# EAGLE design Galaxydrive (EAGLE 9.6.2)
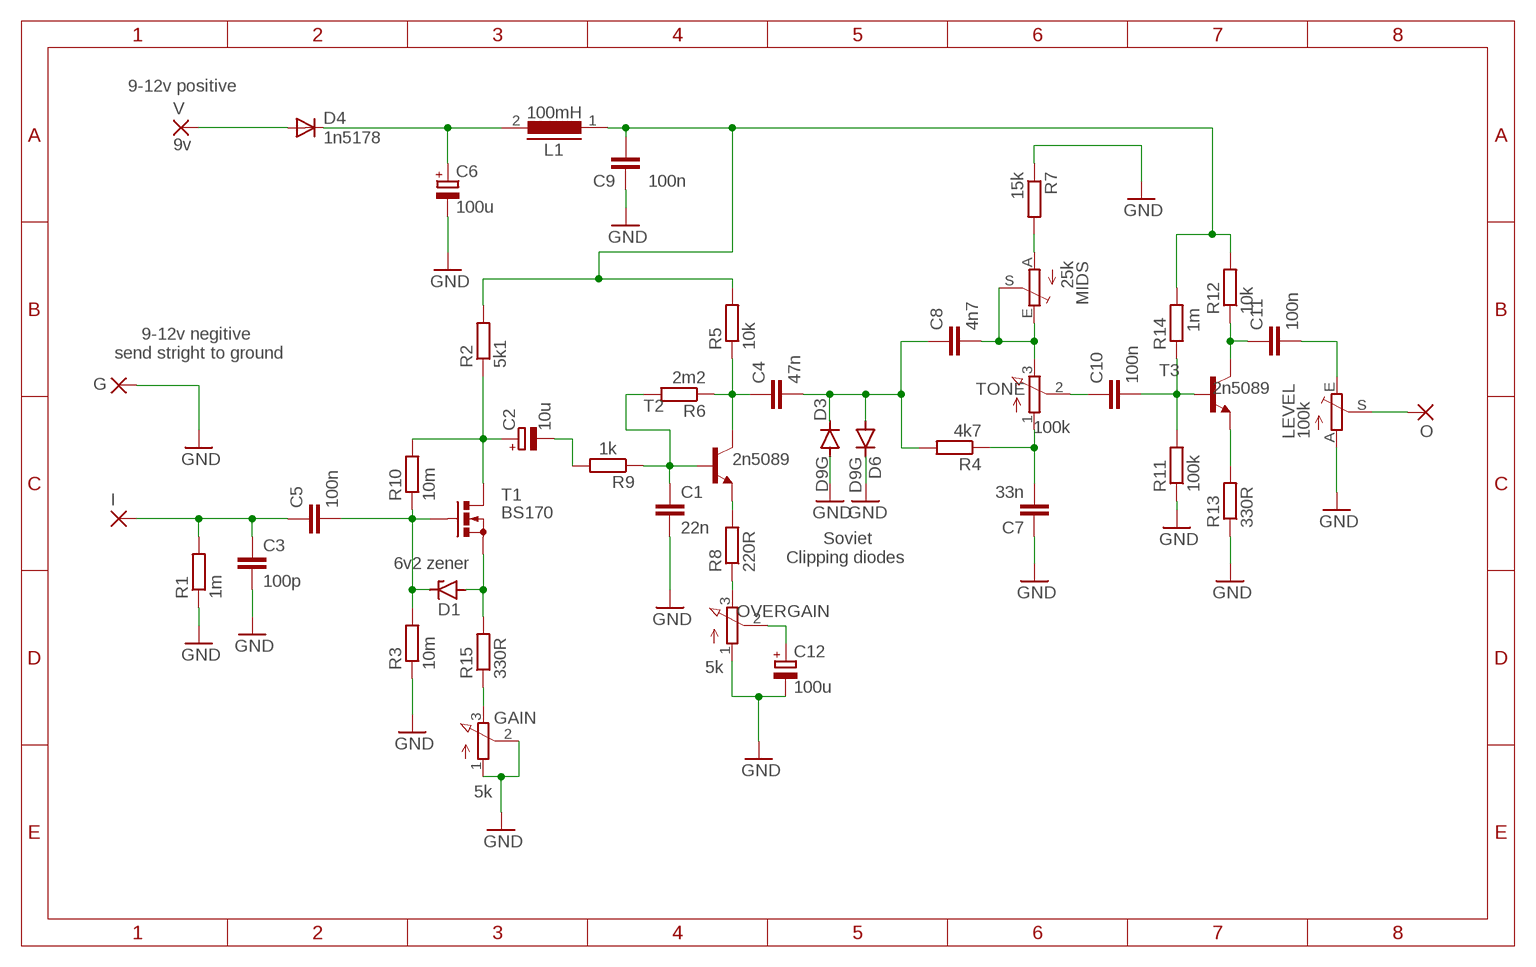
[diagram p0: schematic, sheet 1]

## Parts
C1  22n  C5/2.5  [C5B2.5]
C2  10u  CPOL-EUE1.8-4  [E1,8-4]
C3  100p  C5/2.5  [C5B2.5]
C4  47n  C5/2.5  [C5B2.5]
C5  100n  C5/2.5  [C5B2.5]
C6  100u  CPOL-EUE2-4  [E2-4]
C7  33n  C5/2.5  [C5B2.5]
C8  4n7  C5/2.5  [C5B2.5]
C9  100n  C5/2.5  [C5B2.5]
C10  100n  C5/2.5  [C5B2.5]
C11  100n  C5/2.5  [C5B2.5]
C12  100u  CPOL-EUE2-4  [E2-4]
D1  6v2 zener  BZX90  [DO34Z7]
D3  D9G  OA91  [DO07]
D4  1n5178  DIODE-D-7.5  [D-7.5]
D6  D9G  OA91  [DO07]
G  2,15/1,0  [2,15/1,0]
GAIN  5k  HEXPOT1  [3RP/1610N]
I  2,15/1,0  [2,15/1,0]
L1  100mH  MCC10  [MCC10]
LEVEL  100k  TRIM_EU-B25P  [B25P]
MIDS  25k  TRIM_EU-B25P  [B25P]
O  2,15/1,0  [2,15/1,0]
OVERGAIN  5k  HEXPOT1  [3RP/1610N]
R1  1m  R-EU_0207/7  [0207/7]
R2  5k1  R-EU_0207/7  [0207/7]
R3  10m  R-EU_0207/7  [0207/7]
R4  4k7  R-EU_0207/7  [0207/7]
R5  10k  R-EU_0207/7  [0207/7]
R6  2m2  R-EU_0207/7  [0207/7]
R7  15k  R-EU_0207/7  [0207/7]
R8  220R  R-EU_0207/7  [0207/7]
R9  1k  R-EU_0207/7  [0207/7]
R10  10m  R-EU_0207/7  [0207/7]
R11  100k  R-EU_0207/7  [0207/7]
R12  10k  R-EU_0207/7  [0207/7]
R13  330R  R-EU_0207/7  [0207/7]
R14  1m  R-EU_0207/7  [0207/7]
R15  330R  R-EU_0207/7  [0207/7]
T1  BS170  [SOT54E]
T2  2n5089  2N3904  [TO92]
T3  2n5089  2N3904  [TO92]
TONE  100k  HEXPOT1  [3RP/1610N]
V  9v  2,15/1,0  [2,15/1,0]

## Nets
GND: C1.2 C3.2 C6.- C7.1 C9.1 C12.- D3.A D6.C G.1(P) GAIN.1(A) GAIN.2(S) LEVEL.A OVERGAIN.1(A) R1.1 R3.1 R7.1 R11.1 R13.1
N$1: C2.+ R2.1 R10.2 T1.D
N$2: C4.2 C8.1 D3.C D6.A R4.2
N$3: C5.2 D1.C R3.2 R10.1 T1.G
N$4: D1.A R15.2 T1.S
N$5: C9.2 L1.1 R2.2 R5.2 R12.2 R14.2
N$6: C2.- R9.2
N$7: C8.2 MIDS.E MIDS.S TONE.3(E)
N$8: R8.2 T2.3(E)
N$9: C7.2 R4.1 TONE.1(A)
N$10: C3.1 C5.1 I.1(P) R1.2
N$11: C10.2 R11.2 R14.1 T3.2(B)
N$12: OVERGAIN.3(E) R8.1
N$13: C12.+ OVERGAIN.2(S)
N$14: C1.1 R6.2 R9.1 T2.2(B)
N$15: C11.1 R12.1 T3.1(C)
N$16: C4.1 R5.1 R6.1 T2.1(C)
N$18: R13.2 T3.3(E)
N$19: MIDS.A R7.2
N$20: GAIN.3(E) R15.1
N$21: LEVEL.S O.1(P)
N$22: C10.1 TONE.2(S)
N$23: C11.2 LEVEL.E
N$27: C6.+ D4.C L1.2
N$28: D4.A V.1(P)

## Notes on the sheet
- 9-12v positive
- 9-12v negitive 
  send stright to ground
- Soviet
  Clipping diodes

## Library data of the parts
C1 C3-C5 C7-C11 = hexcapacitor-wima:C: CAPACITOR naming: grid - package width
C2 C6 C12 = hexresistor:CPOL-EU: POLARIZED CAPACITOR, European symbol; SPICEPREFIX: C
D1 = diode:BZX90: Z DIODE
D3 D6 = diode:OA91: DIODE germanium signal diode 115 V 50 mA
D4 = diode-1:DIODE-: DIODE
G I O V = wirepad:2,15/1,0: THROUGH-HOLE PAD
GAIN OVERGAIN TONE = hexpedalpot:HEXPOT1: 16mm Potentiometer one level Source: http://www.alphapotentiometers.net/html/16mm_pot_2.html
L1 = inductors:MCC10: INDUCTOR; SPICEPREFIX: L
LEVEL MIDS = hexpedalpot16mm low pro:TRIM_EU-: POTENTIOMETER
R1-R15 = hexresistor:R-EU_: RESISTOR, European symbol; SPICEPREFIX: R
T1 = transistor-small-signal:BS170: N-CHANNEL MOS FET
T2 T3 = transistor:2N3904: NPN TRANSISTOR

## Net classes
0 default: width 0.254 mm

## Board
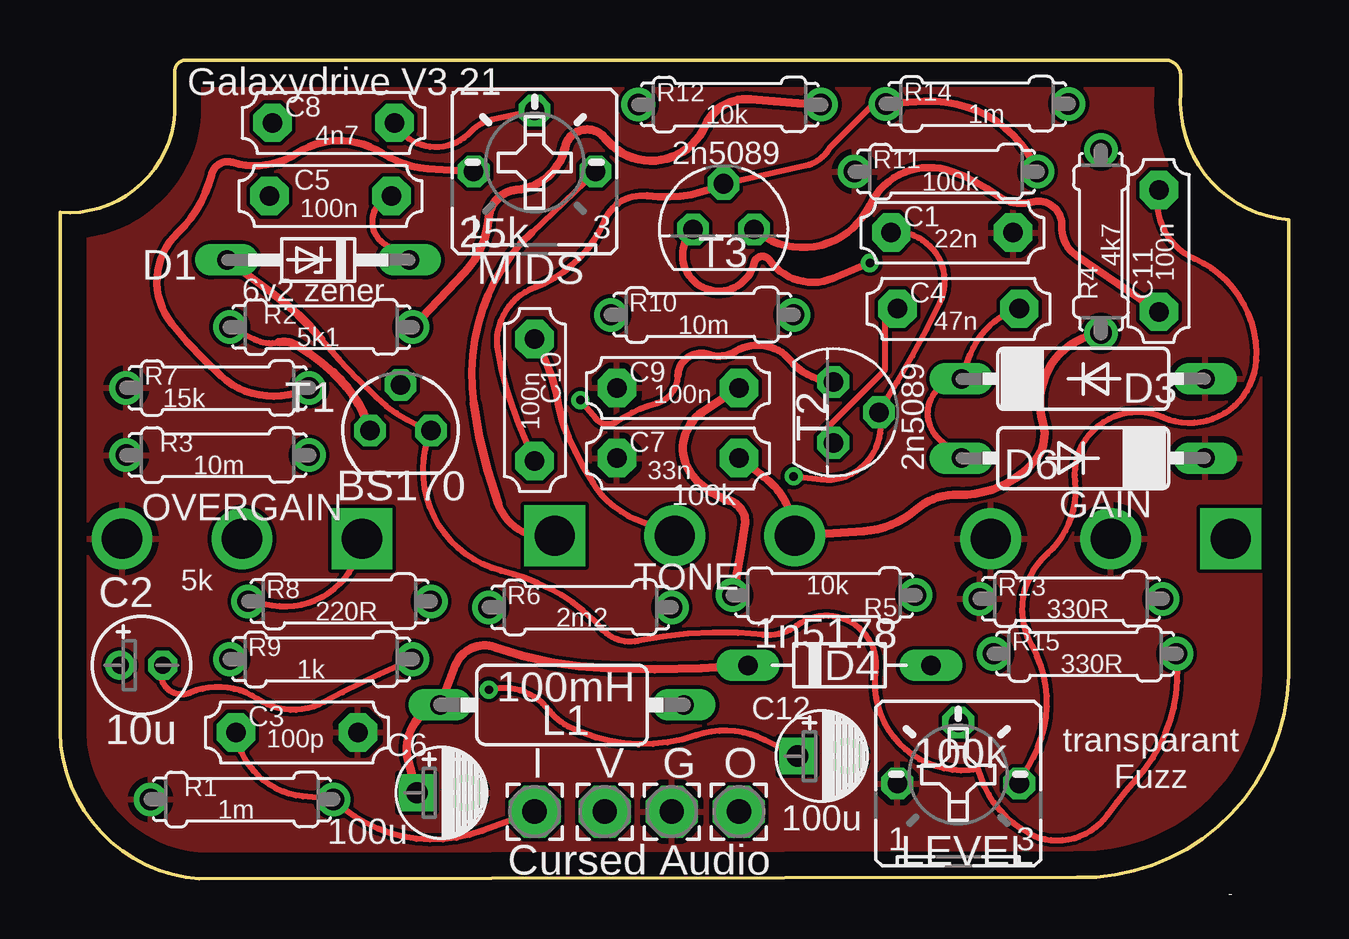
[diagram p1: board, top side]
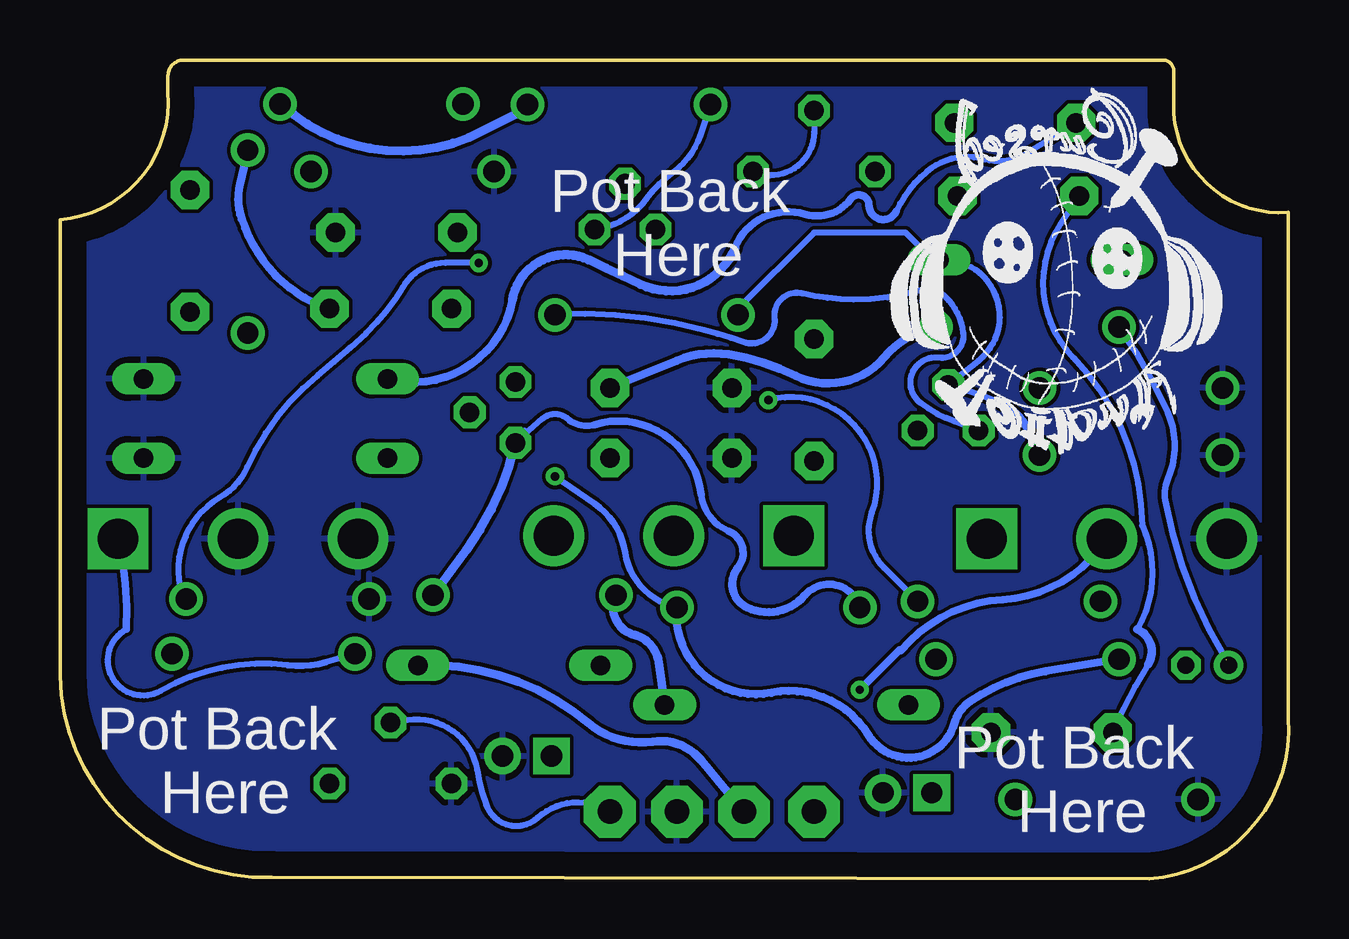
[diagram p2: board, bottom side, seen from below]

Size 51.2 x 34.11 mm. Coordinates in mm from the lower left corner, seen from the top.
Outline: 0.01,6.68 arc90 5.81,0 42.38,0.05 arc90 51.2,8.46 51.2,27.46 arc-90 46.7,32.77 46.7,33.4 arc90 46.06,34.11 5.17,34.11 arc90 4.79,33.53 4.79,31.88 arc-90 0.01,27.76 0.01,6.68
Copper layers (1*16): Top 0.035mm / dielectric 1.5mm / Bottom 0.035mm
Design rules "default": minimum track width 6mil, minimum drill 0.35mm, track to track 6mil, track to pad 6mil, pad to pad 6mil, via to via 6mil, smd to smd 6mil, copper to edge 40mil, drill to drill 6mil, minimum pad ring 10mil, minimum via ring 8mil, stop-mask expansion 4mil, vias tented up to drill 0mil, thermal gap 10mil

### Footprints (pad centres in the part's own frame; a part is rotated, then mirrored left to right if it is on the bottom)
C5B2.5 = drill 0.813 pad 1.6 octagon: 1 -2.54,0; 2 2.54,0
E1,8-4 = drill 0.711 pad 1.168: + -0.889,0 | drill 0.711 pad 1.168 octagon: - 0.889,0
E2-4 = drill 0.889 pad 1.524 square: + -1.016,0 | drill 0.889 pad 1.524: - 1.016,0
DO34Z7 = drill 0.813 long: A 3.81,0; C -3.81,0
DO07 = drill 0.813 long: A 5.08,0; C -5.08,0
D-7.5 = drill 0.813 long: A 3.81,0; C -3.81,0
2,15/1,0 = drill 1.016 pad 2.159 octagon: 1 0,0
3RP/1610N = drill 1.676 pad 2.54: 1 -5,0; 2 0,0 | drill 1.676 pad 2.54 square: 3 5,0
MCC10 = drill 0.813 long: 1 -5.08,0; 2 5.08,0
B25P = drill 0.813 octagon: A -2.54,0; E 2.54,0; S 0,2.54
0207/7 = drill 0.889: 1 -3.81,0; 2 3.81,0
SOT54E = drill 0.813 octagon: D -1.27,0; G 0,1.905; S 1.27,0
TO92 = drill 0.813 octagon: 1 1.27,0; 2 0,1.905; 3 -1.27,0

### Placement (x,y rotation side)
C1  37.17,26.92 0 top
C2  3.39,8.89 0 top
C3  9.87,6.1 0 top
C4  37.43,23.75 0 top
C5  11.27,28.45 0 top
C6  15.89,3.58 0 top
C7  25.74,17.53 0 top
C8  11.39,31.5 0 top
C9  25.74,20.45 0 top
C10  19.78,19.94 270 top
C11  45.79,26.16 90 top
C12  31.74,5.11 0 top
D1  10.76,25.78 180 top
D3  42.64,20.83 0 top
D4  32.48,8.89 0 top
D6  42.64,17.53 180 top
G  25.49,2.79 0 top
GAIN  43.78,14.16 0 top
I  19.78,2.79 0 top
L1  20.92,7.24 180 top
LEVEL  37.43,3.96 0 top
MIDS  19.78,29.46 0 top
O  28.28,2.79 0 top
OVERGAIN  7.58,14.16 0 top
R1  7.58,3.3 0 top
R2  10.89,22.99 0 top
R3  6.57,17.65 0 top
R4  43.37,26.54 90 top
R5  31.84,11.81 180 top
R6  21.68,11.3 0 top
R7  6.57,20.45 0 top
R8  11.65,11.56 0 top
R9  10.89,9.14 0 top
R10  26.76,23.5 0 top
R11  36.92,29.46 0 top
R12  27.9,32.26 0 top
R13  42.13,11.66 0 top
R14  38.22,32.28 0 top
R15  42.71,9.37 0 top
T1  14.19,18.67 0 top
T2  32.22,19.43 270 top
T3  27.65,27.05 0 top
TONE  25.62,14.29 180 top
U$1  [CA]  13.91,22.61 0 top
V  22.7,2.79 0 top

### Tracks (layer width: path | path; a pad name or v marks a point on that pad's centre or on a via)
GND
  pour Bottom: -0.29,28.32 -0.29,6.25 arc90 5.86,0.1 47.26,0.1 arc90 51.45,4.29 51.45,27.51 arc-90 47.33,31.62 47.33,34.2 5.59,34.2 arc-90
  pour Top: -0.21,3.1 -0.21,25.22 4.46,33.59 47.62,33.59 51.53,25.78 51.53,2.54 49.24,0.25 2.63,0.25
N$1  (1 unrouted)
  Top 0.254: R2.1 8.09,22.48 arc39 9.11,22.35
  Top 0.33: 9.11,22.35 arc-44 9.87,22.23
  Top 0.356: 9.87,22.23 arc-11 11.39,21.08
  Top 0.381: 11.39,21.08 arc-30 T1.D
  Bottom 0.254: T1.D 13.93,19.05 arc16 15.33,19.81 arc150 14.57,21.72 arc-104 13.55,22.73 arc-39 14.31,24.26 arc-60 15.33,24.51 arc16 18.12,24.13 arc13 20.28,24.38 arc-110 21.43,23.37 arc116 22.7,22.35 arc-4 24.35,22.86 arc-18 R10.2 | C2.+ 2.63,9.14 2.62,9.15
  Bottom 0.279: 2.61,9.12 arc21 5.14,15.78 arc34 5.04,16.64 arc-48 5.04,19.43 arc-12 R2.1
N$2
  Top 0.254: D6.A 36.67,18.29 arc-137 D3.C 37.94,21.84 arc-53 C4.2
  Bottom 0.254: C8.1 10.89,30.23 arc48 12.66,29.97 arc-55 15.08,29.46 arc-26 16.35,27.81
  Bottom 0.305: 16.35,27.81 arc156 17.49,28.07 arc-144 18.25,28.32 arc70 20.16,27.69 arc-84 23.08,26.29
  Bottom 0.33: 32.35,24.13 arc95 D3.C | R4.2 43.7,28.93 arc-32 43.63,27.48 arc-13 42.94,26.06 arc-20 41.64,24.64 arc-20 C4.2
  Bottom 0.381: 23.08,26.29 arc93 27.01,24.77 arc-1 29.17,25.78 arc-105 32.35,24.13
N$3
  Top 0.254: D1.C 13.55,26.42 arc-130 C5.2
  Bottom 0.254: R10.1 22.95,23.75 19.78,26.92 15.97,26.92 14.7,25.65 D1.C arc146 12.92,21.59 T1.G arc8 12.03,19.81 | R3.2 10.76,18.54
  Bottom 0.33: 10.76,18.54 arc-44 12.03,19.81
N$4
  Top 0.254: 10.89,22.48 arc7 13.17,20.07 arc23 T1.S arc98 18.38,12.83 arc-8 19.9,12.32 arc-26 22.57,10.41 arc61 24.09,9.91 arc-18 29.3,10.16 arc43 30.7,10.54 arc-134 33.99,8.62 arc108 38.26,4.56 arc47 40.35,1.91 arc83 43.65,2.67 arc-7 44.85,4.14 arc49 R15.2
  Top 0.33: D1.A 8.85,24.38
  Top 0.356: 8.85,24.38 arc-14 10.89,22.48
N$5
  Top 0.356: C9.2 26.76,19.43 arc96 26.38,16.76 arc33 27.9,15.75 arc-81 28.54,14.73 arc-3 R5.2 | R2.2 16.85,25.27 arc39 17.87,27.56 arc-81 19.01,28.7 arc73 21.05,30.48 arc-130 22.7,30.86 arc117 26.89,31.37 arc-71 28.78,32.48 arc2 R12.2
  Bottom 0.254: 14.7,22.48 R2.2
  Bottom 0.356: L1.1 26.25,9.02 arc-67 27.27,10.16 arc101 R5.2 | C9.2 25.49,21.59 arc31 23.33,21.84 arc18 20.54,20.96 arc-76 16.85,21.72 arc39 R2.2
  Bottom 0.381: R12.2 31.9,32.01 34.15,30.89 arc65 42,32.3 R14.2
N$6
  Top 0.254: R9.2 13.3,8.51 arc4 11.01,7.37 arc-63 8.22,7.49 arc57 5.42,7.75 arc-137 C2.-
N$7
  Top 0.254: MIDS.S 18,31.62 arc35 17.11,31.12 arc-108 C8.2 | MIDS.E 19.65,26.92
  Top 0.305: 19.65,26.92 arc28 17.62,23.75 arc27 17.24,19.81 | 18.25,15.62 arc82 TONE.3
  Top 0.356: 17.24,19.81 arc12 18.25,15.62
  Bottom 0.254: MIDS.S 19.78,31.12 arc114 MIDS.E
N$8  (via drill 0.35)
  Top 0.254: v21.68,19.94 22.32,19.18 arc84 23.2,19.05 arc-18 24.86,19.81 arc73 25.74,20.96
  Top 0.305: 25.74,20.96 arc-107 27.01,21.84 arc50 28.16,21.97 arc-82 30.44,21.59 arc47 T2.3
  Bottom 0.254: R8.2 16.85,12.95 arc65 17.36,15.24 arc-125 v21.68,19.94
N$9
  Top 0.33: C7.2 29.3,16.76 arc-50 TONE.1
  Top 0.356: TONE.1 33.49,14.48 arc37 35.65,15.37 arc-43 37.43,16 arc51 40.6,17.4 arc57 40.95,19.01 arc-99 R4.1
N$10
  Top 0.254: C3.1 arc76 10.12,3.43 R1.2 arc64 17.59,1.99 I.1
  Bottom 0.254: C5.1 9.49,27.3 arc-78 8.98,21.72 arc44 6.11,14.72 arc54 6.31,10.39 | 5.85,8.94 arc-9 C3.1
  Bottom 0.356: 6.31,10.39 arc98 5.85,8.94
N$11
  Top 0.254: 27.6,28.93 T3.2 31.08,29.72 arc49 32.09,30.48 34.14,32.52 arc38 R14.1 | C10.2 19.14,18.92 arc-13 18.25,21.97 arc-79 19.78,24.64
  Top 0.279: 19.78,24.64 arc46 22.7,27.43 arc-74 24.47,28.45
  Top 0.305: R14.1 36,32.38 arc-71 R11.2 | 24.47,28.45 arc32 27.6,28.93
N$12
  Top 0.254: R8.1 8.84,11.39 arc92 OVERGAIN.3
N$13  (via drill 0.35)
  Top 0.254: C12.+ 29.38,5.78 arc46 26.51,5.97 arc-46 21.17,6.35 arc-25 20.41,6.98 arc66 v17.87,7.87
  Bottom 0.305: v17.87,7.87 16.21,9.54 16.17,9.5 arc46 11.91,11.63 arc-54 OVERGAIN.2
N$14  (via drill 0.35)
  Top 0.254: C1.1 arc-121 36.67,24 arc-5 34.89,20.7 T2.2 arc-111 31.71,16.64 v30.57,16.76
  Bottom 0.279: v30.57,16.76 28.92,15.62 arc47 27.65,13.59 arc-69 R6.2
  Bottom 0.33: R9.1 10.12,8.64 arc-25 13.3,7.37 arc-41 13.93,6.48 arc133 17.49,5.97 arc-70 21.55,7.75 arc107 R6.2
N$15
  Top 0.305: C11.1 42.36,25.95 arc-58 41.75,27.18 arc108 40.48,28.19 arc-51 39.08,28.45 arc16 37.17,29.46 arc85 33.75,28.07 arc-105 T3.1
  Bottom 0.254: R12.1 24.52,30.97 arc35 25.62,29.46 arc-17 26.76,28.32 arc46 T3.1
N$16
  Top 0.254: C4.1 34.38,23.75 34.38,21.21 31.84,18.67 T2.1
  Bottom 0.254: 31.84,18.67 T2.1 31.08,19.18 arc83 30.06,19.18
  Bottom 0.279: 30.06,19.18 arc-58 28.92,18.92 | 24.47,16 arc-60 23.33,14.48
  Bottom 0.305: 28.92,18.92 arc100 24.47,16 | 23.33,14.48 arc106 22.95,12.95 | 20.16,11.81 arc123 R6.1
  Bottom 0.33: 22.95,12.95 arc-104 22.57,11.3 arc-74 20.16,11.81
  Bottom 0.381: R5.1 34.25,13.72 arc-23 T2.1
N$18  (via drill 0.35)
  Top 0.305: v33.75,25.65 32.22,25.02 arc-77 29.55,25.78 arc132 28.92,25.65 arc-212 T3.3
  Bottom 0.254: v33.75,25.65 35.14,25.65 arc-59 36.92,24.64 arc16 38.44,22.73 arc4 40.48,20.96 arc-27 43.4,17.14 arc36 44.54,15.88 arc-67 46.24,12.47 arc-28 R13.2
N$19
  Top 0.305: MIDS.A 15.33,29.59 arc-29 13.43,30.23 arc66 9.87,30.23 arc-50 7.2,29.84 arc93 6.31,29.34 arc-33 4.92,26.92 arc85 4.66,23.11 arc9 6.69,20.96 arc69 R7.2
N$20
  Bottom 0.254: R15.1 40.12,9.02 | 41.7,8.89 arc-37 47,7.82 arc182 48.43,10.39
  Bottom 0.279: 40.12,9.02 arc23 41.7,8.89
  Bottom 0.305: 48.43,10.39 arc-16 GAIN.3
N$21
  Bottom 0.254: LEVEL.S 36.71,6.61 arc89 33.82,4.53 arc-10 33.44,3.08 arc-112 31.29,2.54 arc75 O.1
N$22
  Top 0.254: TONE.2 23.97,14.99 arc-35 22.19,16.51
  Top 0.279: 22.19,16.51 arc-7 21.17,18.41
  Top 0.305: 21.17,18.41 arc-15 20.79,19.68 arc22 C10.1
N$23
  Top 0.254: LEVEL.E 40.55,5.05 arc58 40.5,9.7 arc-78 41.14,13.54 arc54 42.31,16.56 arc-120 45.96,19.23 arc110 49.85,21.59 arc70 47.28,25.82 arc-78 C11.2
N$27
  Top 0.356: C6.+ 14.52,4.92 arc-89 L1.2 16.47,8.89 arc-88 18.12,9.65 arc17 22.82,8.76 arc7 D4.C
N$28
  Bottom 0.356: V.1 24.48,4.94 arc-58 26.51,5.71 arc48 29.17,6.48 arc-43 D4.A

### Text on the board
tNames: Galaxydrive V3.21 | 2n5089 | 6v2 zener | 100n | 2n5089 | transparant / Fuzz | Cursed Audio
bNames: Pot Back / Here | Pot Back / Here | Pot Back / Here